# Altium schematic sheet FPGA_System_Monitor.SchDoc: FPGA_System_Monitor
size A3; Date: 18/06/2014; DrawnBy: J. Gabriel R.E.; Organization: Seven Solutions S.L.; Address1: C/Baza, Parcela 19, Nave 3; Address2: Polнgono Ind. Juncaril; Address3: 18210-Peligros-Granada; Address4: Spain; Revision: 3.4; SheetNumber: 19; SheetTotal: 23; WebAddress: www.sevensols.com; Project: White Rabbit; ProjectName: Project Name
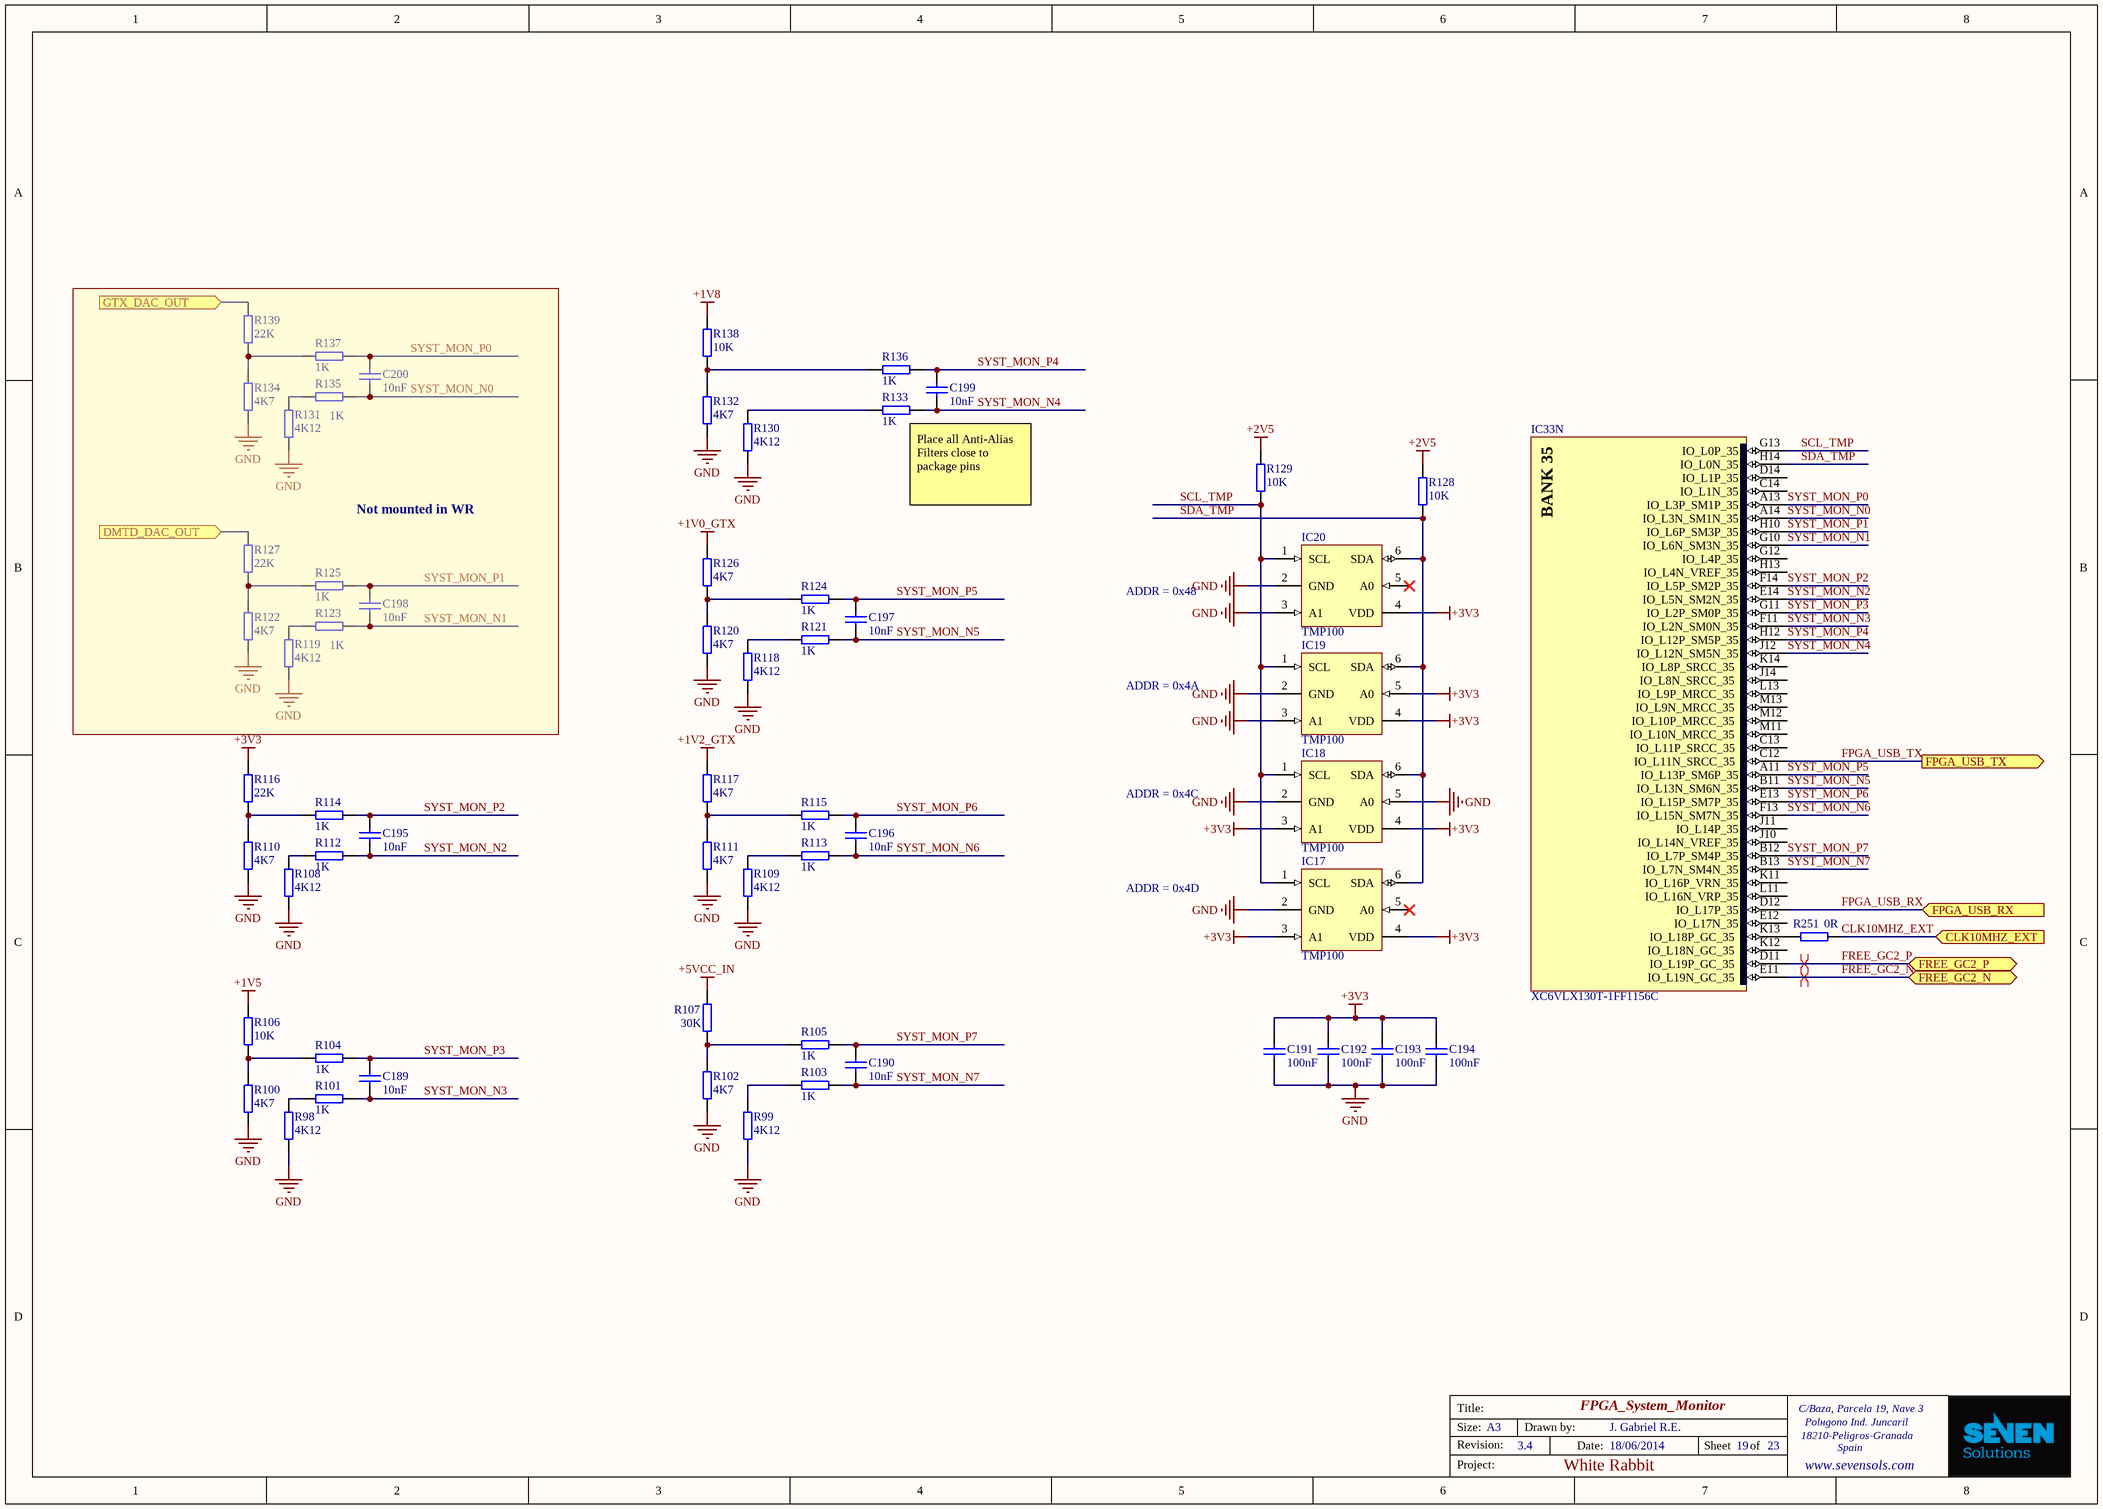
[diagram p0: FPGA_System_Monitor.SchDoc]

## Parts
C189  10nF  [CC1005-0402]
C190  10nF  [CC1005-0402]
C191  100nF  [CC1005-0402]
C192  100nF  [CC1005-0402]
C193  100nF  [CC1005-0402]
C194  100nF  [CC1005-0402]
C195  10nF  [CC1005-0402]
C196  10nF  [CC1005-0402]
C197  10nF  [CC1005-0402]
C198  10nF  [CC1005-0402]
C199  10nF  [CC1005-0402]
C200  10nF  [CC1005-0402]
IC17  TMP100  [SOT23A-6L]
IC18  TMP100  [SOT23A-6L]
IC19  TMP100  [SOT23A-6L]
IC20  TMP100  [SOT23A-6L]
IC33  XC6VLX130T-1FF1156C  [FF1156]  (part N of 20)
R98  4K12  [0402]
R99  4K12  [0402]
R100  4K7  [0402]
R101  1K  [0402]
R102  4K7  [0402]
R103  1K  [0402]
R104  1K  [0402]
R105  1K  [0402]
R106  10k  [0402]
R107  30K  [0402]
R108  4K12  [0402]
R109  4K12  [0402]
R110  4K7  [0402]
R111  4K7  [0402]
R112  1K  [0402]
R113  1K  [0402]
R114  1K  [0402]
R115  1K  [0402]
R116  22K  [0402]
R117  4K7  [0402]
R118  4K12  [0402]
R119  4K12  [0402]
R120  4K7  [0402]
R121  1K  [0402]
R122  4K7  [0402]
R123  1K  [0402]
R124  1K  [0402]
R125  1K  [0402]
R126  4K7  [0402]
R127  22K  [0402]
R128  10k  [0402]
R129  10k  [0402]
R130  4K12  [0402]
R131  4K12  [0402]
R132  4K7  [0402]
R133  1K  [0402]
R134  4K7  [0402]
R135  1K  [0402]
R136  1K  [0402]
R137  1K  [0402]
R138  10k  [0402]
R139  22K  [0402]
R251  value 0R  [0402]  (hidden comment: Jumper)

## Blocks framed on the sheet
Not mounted in WR: C198 C200 R119 R122 R123 R125 R127 R131 R134 R135 R137 R139

## Ports
CLK10MHZ_EXT (in), DMTD_DAC_OUT (in), FPGA_USB_RX (in), FPGA_USB_TX (out), FREE_GC2_N (bidir), FREE_GC2_P (bidir), GTX_DAC_OUT (in)

## Nets
+1V0_GTX: R126.2
+1V2_GTX: R117.2
+1V5: R106.2
+1V8: R138.2
+2V5: R128.2 R129.2
+3V3: C191.1 C192.1 C193.1 C194.1 IC17.3(A1) IC17.4(VDD) IC18.3(A1) IC18.4(VDD) IC19.4(VDD) IC19.5(A0) IC20.4(VDD) R116.2
+5VCC_IN: R107.2
GND: C191.2 C192.2 C193.2 C194.2 IC17.2(GND) IC18.2(GND) IC18.5(A0) IC19.2(GND) IC19.3(A1) IC20.2(GND) IC20.3(A1) R98.1 R99.1 R100.1 R102.1 R108.1 R109.1 R110.1 R111.1 R118.1 R119.1 R120.1 R122.1 R130.1 R131.1 R132.1 R134.1
CLK10MHZ_EXT: R251.1 ; port CLK10MHZ_EXT
DMTD_DAC_OUT: R127.2 ; port DMTD_DAC_OUT
FPGA_USB_RX: IC33.D12(IO_L17P_35) ; port FPGA_USB_RX
FPGA_USB_TX: IC33.C12(IO_L11N_SRCC_35) ; port FPGA_USB_TX
FREE_GC2_N: IC33.E11(IO_L19N_GC_35) ; port FREE_GC2_N
FREE_GC2_P: IC33.D11(IO_L19P_GC_35) ; port FREE_GC2_P
GTX_DAC_OUT: R139.2 ; port GTX_DAC_OUT
SCL_TMP: IC17.1(SCL) IC18.1(SCL) IC19.1(SCL) IC20.1(SCL) IC33.G13(IO_L0P_35) R129.1
SDA_TMP: IC17.6(SDA) IC18.6(SDA) IC19.6(SDA) IC20.6(SDA) IC33.H14(IO_L0N_35) R128.1
SYST_MON_N0: C200.1 IC33.A14(IO_L3N_SM1N_35) R135.1
SYST_MON_N1: C198.1 IC33.G10(IO_L6N_SM3N_35) R123.1
SYST_MON_N2: C195.1 IC33.E14(IO_L5N_SM2N_35) R112.1
SYST_MON_N3: C189.1 IC33.F11(IO_L2N_SM0N_35) R101.1
SYST_MON_N4: C199.1 IC33.J12(IO_L12N_SM5N_35) R133.1
SYST_MON_N5: C197.1 IC33.B11(IO_L13N_SM6N_35) R121.1
SYST_MON_N6: C196.1 IC33.F13(IO_L15N_SM7N_35) R113.1
SYST_MON_N7: C190.1 IC33.B13(IO_L7N_SM4N_35) R103.1
SYST_MON_P0: C200.2 IC33.A13(IO_L3P_SM1P_35) R137.1
SYST_MON_P1: C198.2 IC33.H10(IO_L6P_SM3P_35) R125.1
SYST_MON_P2: C195.2 IC33.F14(IO_L5P_SM2P_35) R114.1
SYST_MON_P3: C189.2 IC33.G11(IO_L2P_SM0P_35) R104.1
SYST_MON_P4: C199.2 IC33.H12(IO_L12P_SM5P_35) R136.1
SYST_MON_P5: C197.2 IC33.A11(IO_L13P_SM6P_35) R124.1
SYST_MON_P6: C196.2 IC33.E13(IO_L15P_SM7P_35) R115.1
SYST_MON_P7: C190.2 IC33.B12(IO_L7P_SM4P_35) R105.1
NetIC33_K13: IC33.K13(IO_L18P_GC_35) R251.2
NetR98_2: R98.2 R101.2
NetR99_2: R99.2 R103.2
NetR100_2: R100.2 R104.2 R106.1
NetR102_2: R102.2 R105.2 R107.1
NetR108_2: R108.2 R112.2
NetR109_2: R109.2 R113.2
NetR110_2: R110.2 R114.2 R116.1
NetR111_2: R111.2 R115.2 R117.1
NetR118_2: R118.2 R121.2
NetR119_2: R119.2 R123.2
NetR120_2: R120.2 R124.2 R126.1
NetR122_2: R122.2 R125.2 R127.1
NetR130_2: R130.2 R133.2
NetR131_2: R131.2 R135.2
NetR132_2: R132.2 R136.2 R138.1
NetR134_2: R134.2 R137.2 R139.1

Not connected (* = marked no-connect by the designer): IC17 5(A0)*; IC20 5(A0)*; IC33 C13(IO_L11P_SRCC_35) C14(IO_L1N_35) D14(IO_L1P_35) E12(IO_L17N_35) G12(IO_L4P_35) H13(IO_L4N_VREF_35) J10(IO_L14N_VREF_35) J11(IO_L14P_35) J14(IO_L8N_SRCC_35) K11(IO_L16P_VRN_35) K12(IO_L18N_GC_35) K14(IO_L8P_SRCC_35) L11(IO_L16N_VRP_35) L13(IO_L9P_MRCC_35) M11(IO_L10N_MRCC_35) M12(IO_L10P_MRCC_35) M13(IO_L9N_MRCC_35)

## Layout directives
differential pair: FREE_GC2_N, FREE_GC2_P

## Notes on the sheet
- (near R133) Place all Anti-Alias Filters close to package pins
- ADDR = 0x48
- ADDR = 0x4A
- ADDR = 0x4C
- ADDR = 0x4D
- Title:
- Size:
- Revision:
- A3
- Drawn by:
- Date:
- Sheet
- of
- Project:
- (in symbol XC6VLX130T-1FF1156C, part N) BANK 35

## Library data of the parts
C189 C190 C195-C197 C199 = CC0402_10NF_25V_10%_X7R: Capacitor; Manufacturer1: TDK; Manufacturer1 PN: C1005X7R1E103K; TC: X7R; Tolerance: ±10%; Voltage: 25V; Published: 8-Jun-2000; LatestRevisionDate: 17-Jul-2002; LatestRevisionNote: Re-released for DXP Platform.; PackageReference: RAD-0.3; Publisher: Altium Limited; Distributor1: Digikey; Distributor1 PN: 445-1260-1-ND; Case: 0402; Value: 10nF
C191-C194 = CC0402_100NF_16V_10%_X7R: Capacitor; Manufacturer1: TDK; Manufacturer1 PN: C1005X7R1C104K; TC: X7R; Tolerance: ±10%; Voltage: 16V; Published: 8-Jun-2000; LatestRevisionDate: 17-Jul-2002; LatestRevisionNote: Re-released for DXP Platform.; PackageReference: RAD-0.3; Publisher: Altium Limited; Distributor1: Digikey; Distributor1 PN: 445-4952-1-ND; Case: 0402; Value: 100nF
C198 C200 = CC0402_10NF_25V_10%_X7R: Capacitor; Manufacturer1: TDK; Manufacturer1 PN: C1005X7R1E103K; TC: X7R; Tolerance: ±10%; Voltage: 25V; Mounted: No; Published: 8-Jun-2000; LatestRevisionDate: 17-Jul-2002; LatestRevisionNote: Re-released for DXP Platform.; PackageReference: RAD-0.3; Publisher: Altium Limited; Distributor1: Digikey; Distributor1 PN: 445-1260-1-ND; Case: 0402; Value: 10nF
IC17-IC20 = TMP100: I2C temp. sensor; RefId: 296-12749-1-ND; Value: TMP100NA/250; Supplier: Digikey
IC33 = XC6VLX130T-1FF1156C: Virtex-6 LXT Platform FPGA, 600 User I/Os, 20 GTXs, 1156-Ball FFBGA, Speed Grade 1, Commercial Grade; FirstPublished: 17-Nov-2009; DatasheetVersion: v2.0, Sep-2009; PackageVersion: ver1.0, Jun-2009; PackageReference: FF1156; Publisher: Altium Limited; PackageDescription: 1156-Ball Flip-Chip Fine Pitch Ball Grid Array (FF1156); Code_JEDEC: MS-034-AAR-1; Code_IPC: BGA100P34X34-1156; ComponentLink1Description: Virtex-6 Datasheet; ComponentLink1URL: http://www.xilinx.com/support/documentation/data_sheets/ds150.pdf; ComponentLink2Description: Pinout Specification; ComponentLink2URL: http://www.xilinx.com/support/packagefiles/virtex-6-pkgs.htm; ComponentLink3Description: FF1156 Package Drawing; ComponentLink3URL: http://www.xilinx.com/support/documentation/package_specs/ff1156.pdf; ComponentLink4Description: Virtex-6 Documents; ComponentLink4URL: http://www.xilinx.com/support/documentation/virtex-6.htm; ComponentLink5Description: Xilinx.com Home; ComponentLink5URL: http://www.xilinx.com
R98 R99 R108 R109 R118 R130 = R0402_4K12_±1%_0.1W_100PPM: SMD Resistor; Manufacturer1: Panasonic; Manufacturer1 PN: ERJ-2RKF4121X; TCR: 100ppm; Power Rating: 0.1W; Tolerance: ±1%; Case: 0402; Distributor1: DigiKey; Distributor1 PN: P4.12KLCT-ND; Value: 4K12
R100 R102 R110 R111 R117 R120 R126 R132 = R0402_4.7K_±1%_0.1W_100PPM: SMD Resistor; Manufacturer1: Panasonic; Manufacturer1 PN: ERJ-2RKF4701X; TCR: 100ppm; Power Rating: 0.1W; Tolerance: ±1%; Case: 0402; Distributor1: DigiKey; Distributor1 PN: ERJ-2RKF4701X; Value: 4K7
R101 R103-R105 R112-R115 R121 R124 R133 R136 = R0402_1K_±1%_0.1W_100PPM: SMD Resistor; Manufacturer1: Panasonic; Manufacturer1 PN: ERJ-2RKF1001X; TCR: 100ppm; Power Rating: 0.1W; Tolerance: ±1%; Case: 0402; Distributor1: DigiKey; Distributor1 PN: P1.00KLCT-ND; Value: 1K
R106 R128 R129 R138 = R0402_10K_±1%_0.1W_100PPM: SMD Resistor; Manufacturer1: Panasonic; Manufacturer1 PN: ERJ-2RKF1002X; TCR: 100ppm; Power Rating: 0.1W; Tolerance: ±1%; Case: 0402; Distributor1: DigiKey; Distributor1 PN: P10.0KLCT-ND; Value: 10K
R107 = R0402_30K_±1%_0.1W_100PPM: SMD Resistor; Manufacturer1: Panasonic; Manufacturer1 PN: ERJ-2RKF3002X; TCR: 100ppm; Power Rating: 0.1W; Tolerance: ±1%; Case: 0402; Distributor1: DigiKey; Distributor1 PN: P30.0KLCT-ND; Value: 30K
R116 = R0402_22K_±1%_0.1W_100PPM: SMD Resistor; Manufacturer1: Panasonic; Manufacturer1 PN: ERJ-2RKF2202X; TCR: 100ppm; Power Rating: 0.1W; Tolerance: ±1%; Case: 0402; Distributor1: DigiKey; Distributor1 PN: P22.0KLCT-ND; Value: 22K
R119 R131 = R0402_4K12_±1%_0.1W_100PPM: SMD Resistor; Manufacturer1: Panasonic; Manufacturer1 PN: ERJ-2RKF4121X; TCR: 100ppm; Power Rating: 0.1W; Tolerance: ±1%; Mounted: No; Case: 0402; Distributor1: DigiKey; Distributor1 PN: P4.12KLCT-ND; Value: 4K12
R122 R134 = R0402_4.7K_±1%_0.1W_100PPM: SMD Resistor; Manufacturer1: Panasonic; Manufacturer1 PN: ERJ-2RKF4701X; TCR: 100ppm; Power Rating: 0.1W; Tolerance: ±1%; Mounted: No; Case: 0402; Distributor1: DigiKey; Distributor1 PN: ERJ-2RKF4701X; Value: 4K7
R123 R125 R135 R137 = R0402_1K_±1%_0.1W_100PPM: SMD Resistor; Manufacturer1: Panasonic; Manufacturer1 PN: ERJ-2RKF1001X; TCR: 100ppm; Power Rating: 0.1W; Tolerance: ±1%; Mounted: No; Case: 0402; Distributor1: DigiKey; Distributor1 PN: P1.00KLCT-ND; Value: 1K
R127 R139 = R0402_22K_±1%_0.1W_100PPM: SMD Resistor; Manufacturer1: Panasonic; Manufacturer1 PN: ERJ-2RKF2202X; TCR: 100ppm; Power Rating: 0.1W; Tolerance: ±1%; Mounted: No; Case: 0402; Distributor1: DigiKey; Distributor1 PN: P22.0KLCT-ND; Value: 22K
R251 = R0402_0R_0.1W_JUMPER: SMD Resistor; Manufacturer1: Panasonic; Manufacturer1 PN: ERJ-2GE0R00X; TCR: 100ppm; Power Rating: 0.1W; Case: 0402; Distributor1: DigiKey; Distributor1 PN: P0.0JCT-ND; Tolerance: Jumper